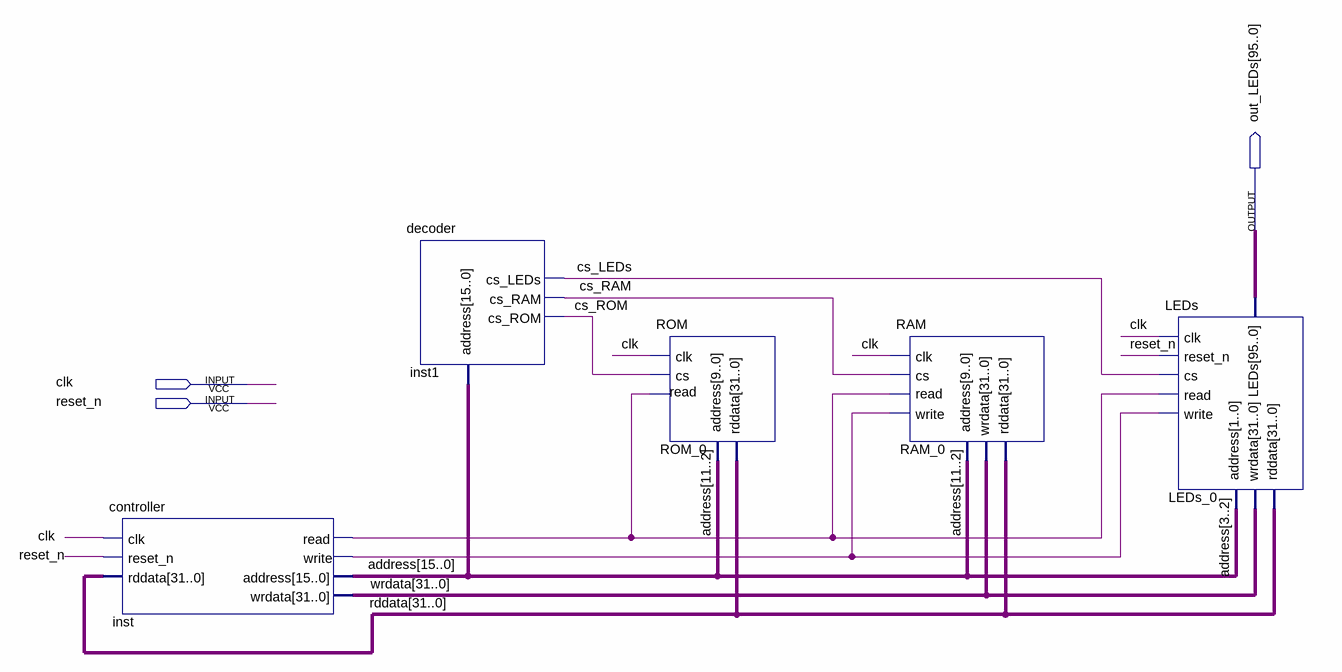
[diagram p0: schematic sheet]
// Quartus schematic FPGA4U.bdf as structural Verilog: 5 symbols, 3 pins
module FPGA4U (
  input  clk,
  input  reset_n,
  output [95:0] out_LEDs
);

  wire cs_LEDs, cs_RAM, cs_ROM, inst_read, inst_write;
  wire [15:0] address;
  wire [31:0] rddata, wrdata;

  controller inst (
    .clk(clk), .reset_n(reset_n), .rddata(rddata), .read(inst_read), .write(inst_write), .address(address),
    .wrdata(wrdata));
  decoder inst1 (.address(address), .cs_RAM(cs_RAM), .cs_ROM(cs_ROM), .cs_LEDs(cs_LEDs));
  ROM ROM_0 (.clk(clk), .cs(cs_ROM), .read(inst_read), .address(address[11:2]), .rddata(rddata));
  RAM RAM_0 (
    .clk(clk), .cs(cs_RAM), .write(inst_write), .wrdata(wrdata), .read(inst_read), .address(address[11:2]),
    .rddata(rddata));
  LEDs LEDs_0 (
    .clk(clk), .reset_n(reset_n), .cs(cs_LEDs), .write(inst_write), .address(address[3:2]), .wrdata(wrdata),
    .read(inst_read), .rddata(rddata), .LEDs(out_LEDs));
endmodule
